# Altium schematic sheet AD603_MCP41010.SchDoc
size A4
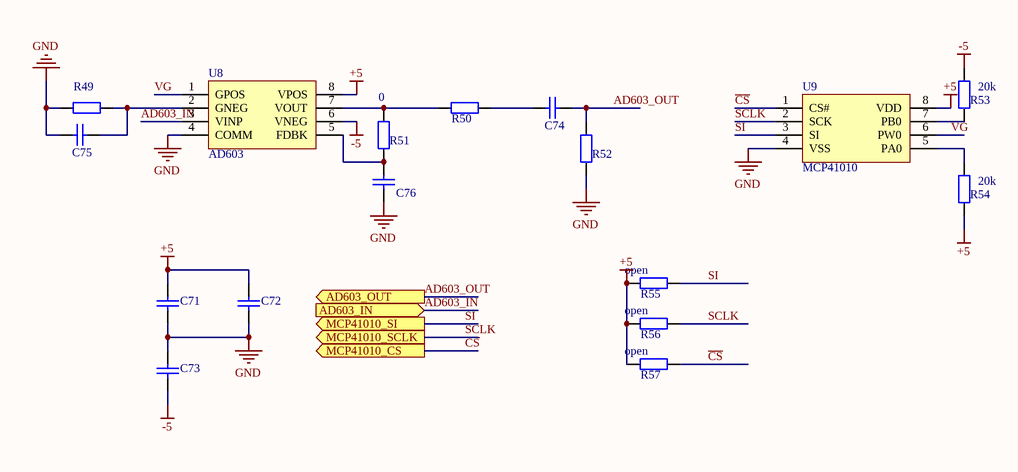
[diagram p0: AD603_MCP41010.SchDoc]

## Parts
C71  100nF (104) 10% 50V  [0603_C]  (value not drawn)
C72  100nF (104) 10% 50V  [0603_C]  (value not drawn)
C73  100nF (104) 10% 50V  [0603_C]  (value not drawn)
C74  100nF (104) 10% 50V  [0603_C]  (value not drawn)
C75  100nF (104) 10% 50V  [0603_C]  (value not drawn)
C76  10pf  [0603_C]  (value not drawn)
R49  10KΩ (1002) ±1%  [0603_R]  (value not drawn)
R50  10KΩ (1002) ±1%  [0603_R]  (value not drawn)
R51  0  [0603_R]
R52  10KΩ (1002) ±1%  [0603_R]  (value not drawn)
R53  20k  [0603_R]
R54  20k  [0603_R]
R55  open  [0603_R]
R56  open  [0603_R]
R57  open  [0603_R]
U8  AD603  [SO-8]
U9  MCP41010  [SOIC-8]

## Ports
AD603_IN (in), AD603_OUT (out), MCP41010_CS (out), MCP41010_SCLK (out), MCP41010_SI (out)

## Nets
+5: C71.2 C72.2 R54.2 R55.1 R56.1 R57.1 U8.8(VPOS) U9.8(VDD)
-5: C73.1 R53.1 U8.6(VNEG)
GND: C71.1 C72.1 C73.2 C75.2 C76.2 R49.2 R52.1 U8.4(COMM) U9.4(VSS)
AD603_IN: U8.3(VINP) ; port AD603_IN
AD603_OUT: C74.1 R52.2 ; port AD603_OUT
~{CS}: R57.2 U9.1(CS#) ; port MCP41010_CS
SCLK: R56.2 U9.2(SCK) ; port MCP41010_SCLK
SI: R55.2 U9.3(SI) ; port MCP41010_SI
VG: U8.1(GPOS) U9.6(PW0)
NetC74_2: C74.2 R50.2
NetC75_1: C75.1 R49.1 U8.2(GNEG)
NetC76_1: C76.1 R51.2 U8.5(FDBK)
NetR50_1: R50.1 R51.1 U8.7(VOUT)
NetR53_2: R53.2 U9.7(PB0)
NetR54_1: R54.1 U9.5(PA0)

## Library data of the parts
C71-C76 = 0603 100nF (104) 10% 50V: 贴片电容; ComponentLink1Description: 供应商链接; ComponentLink1URL: http://www.szlcsc.com/product/details_15331.html; Package: 0603; Supplier: LC; SuppliersPartNumber: C14663
R49-R57 = 0603 10KΩ (1002) 1%: 贴片电阻; ComponentLink1Description: 供应商链接; ComponentLink1URL: http://www.szlcsc.com/product/details_26547.html; Package: 0603; Supplier: LC; SuppliersPartNumber: C25804
U9 = IC_MCP41010T